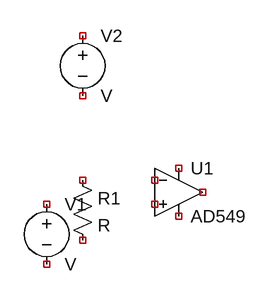
[diagram p0: schematic Draft27.asc]
Draft27.asc, the LTspice schematic file:
Version 4.1
SHEET 1 880 680
SYMBOL OpAmps\\AD549 144 96 R0
SYMATTR InstName U1
SYMBOL voltage -32 160 R0
SYMATTR InstName V1
SYMBOL voltage 16 -64 R0
SYMATTR InstName V2
SYMBOL res 0 128 R0
SYMATTR InstName R1

The netlist it stands for:
* Draft27.asc
X§U1 NC_01 NC_02 NC_03 NC_04 NC_05 AD549  ; pins In+ In- V+ V- OUT
V1 NC_06 NC_07 V
V2 NC_08 NC_09 V
R1 NC_10 NC_11 R
.backanno
.end